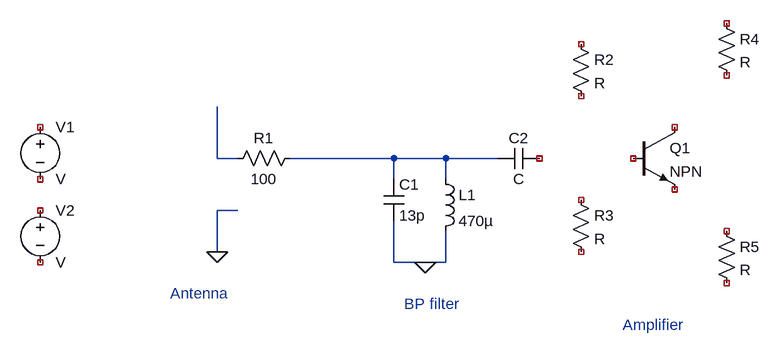
[diagram p0: schematic general.asc]
general.asc, the LTspice schematic file:
Version 4
SHEET 1 880 680
WIRE -144 48 -144 -32
WIRE -112 48 -144 48
WIRE 128 48 -32 48
WIRE 208 48 128 48
WIRE 288 48 208 48
WIRE 128 80 128 48
WIRE 208 80 208 48
WIRE -112 128 -144 128
WIRE -144 192 -144 128
WIRE 128 208 128 144
WIRE 176 208 128 208
WIRE 208 208 208 160
WIRE 208 208 176 208
FLAG -144 192 0
FLAG 176 208 0
SYMBOL cap 112 80 R0
SYMATTR InstName C1
SYMATTR Value 13p
SYMBOL ind 192 64 R0
SYMATTR InstName L1
SYMATTR Value 470µ
SYMBOL res -16 32 R90
WINDOW 0 0 56 VBottom 2
WINDOW 3 32 56 VTop 2
SYMATTR InstName R1
SYMATTR Value 100
SYMBOL voltage -416 -16 R0
SYMATTR InstName V1
SYMBOL voltage -416 112 R0
SYMATTR InstName V2
SYMBOL res 400 -144 R0
SYMATTR InstName R2
SYMBOL res 400 96 R0
SYMATTR InstName R3
SYMBOL cap 352 32 R90
WINDOW 0 0 32 VBottom 2
WINDOW 3 32 32 VTop 2
SYMATTR InstName C2
SYMBOL res 624 -176 R0
SYMATTR InstName R4
SYMBOL res 624 144 R0
SYMATTR InstName R5
SYMBOL npn 496 0 R0
SYMATTR InstName Q1
TEXT -216 256 Left 2 ;Antenna
TEXT 144 272 Left 2 ;BP filter
TEXT 480 304 Left 2 ;Amplifier

The netlist it stands for:
* general.asc
C1 N002 0 13p
L1 N002 0 470µ
R1 N002 N001 100
V1 NC_01 NC_02 V
V2 NC_03 NC_04 V
R2 NC_05 NC_06 R
R3 NC_07 NC_08 R
C2 NC_09 N002 C
R4 NC_10 NC_11 R
R5 NC_12 NC_13 R
Q1 NC_14 NC_15 NC_16 0 NPN
.model NPN NPN
.model PNP PNP
.lib standard.bjt
* Antenna
* BP filter
* Amplifier
.backanno
.end